# Altium schematic sheet lcd_pin.SchDoc
size A
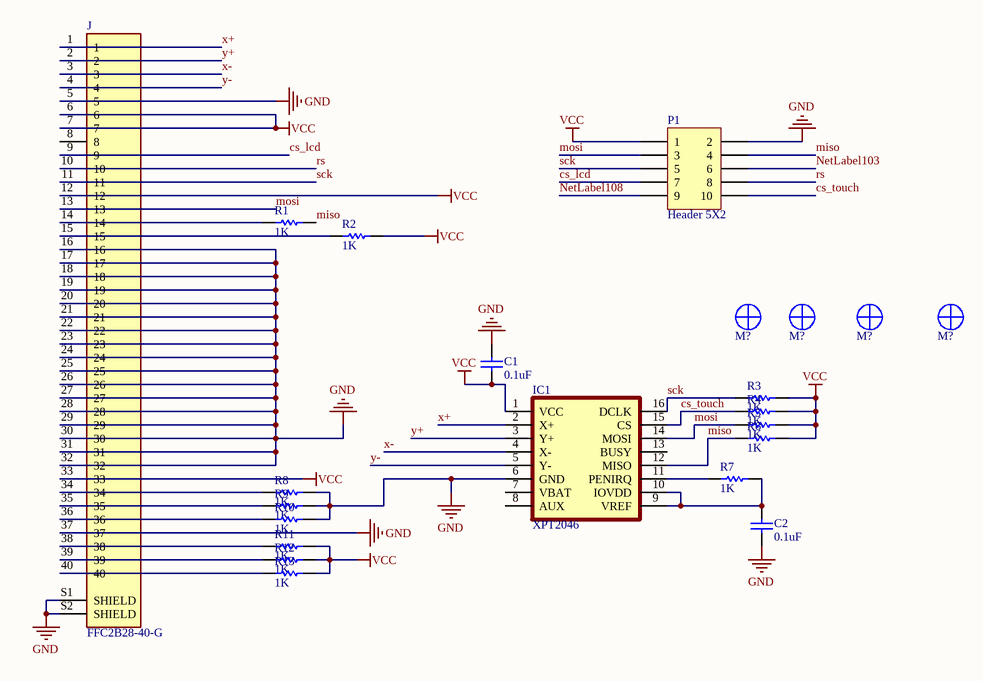
[diagram p0: lcd_pin.SchDoc]

## Parts
(Parts that share a designator on the sheet are numbered #1, #2 ... from top to bottom, then left to right.)
C1  0.1uF  [CAPC4817X12N]
C2  0.1uF  [CAPC4817X12N]
IC1  XPT2046  [TSSOP16]
J  FFC2B28-40-G  [GCT_FFC2B28-40-G]
M?#1  Screw  [Board Screw]  (value not drawn)
M?#2  Screw  [Board Screw]  (value not drawn)
M?#3  Screw  [Board Screw]  (value not drawn)
M?#4  Screw  [Board Screw]  (value not drawn)
P1  Header 5X2  [HDR2X5]
R1  1K  [RESC4817X04N]
R2  1K  [RESC4817X04N]
R3  1K  [RESC4817X04N]
R4  1K  [RESC4817X04N]
R5  1K  [RESC4817X04N]
R6  1K  [RESC4817X04N]
R7  1K  [RESC4817X04N]
R8  1K  [RESC4817X04N]
R9  1K  [RESC4817X04N]
R10  1K  [RESC4817X04N]
R11  1K  [RESC4817X04N]
R12  1K  [RESC4817X04N]
R13  1K  [RESC4817X04N]

## Nets
GND: C1.2 C2.1 IC1.6(GND) J.5 J.16 J.17 J.18 J.19 J.20 J.21 J.22 J.23 J.24 J.25 J.26 J.27 J.28 J.29 J.30 J.31 J.32 J.37 J.S1(SHIELD) J.S2(SHIELD) P1.2 R8.2 R9.2 R10.2
VCC: C1.1 IC1.1(VCC) J.6 J.7 J.12 J.33 P1.1 R2.2 R3.2 R4.2 R5.2 R6.2 R11.2 R12.2 R13.2
cs_lcd: J.9 P1.7
cs_touch: IC1.15(CS) P1.10 R4.1
miso: IC1.12(MISO) P1.4 R1.2 R6.1
mosi: IC1.14(MOSI) J.13 P1.3 R5.1
NetLabel103: P1.6
NetLabel108: P1.9
rs: J.10 P1.8
sck: IC1.16(DCLK) J.11 P1.5 R3.1
x+: IC1.2(X+) J.1
x-: IC1.4(X-) J.3
y+: IC1.3(Y+) J.2
y-: IC1.5(Y-) J.4
NetC2_2: C2.2 IC1.9(VREF) IC1.10(IOVDD) R7.2
NetIC1_11: IC1.11(PENIRQ) R7.1
NetJ_14: J.14 R1.1
NetJ_15: J.15 R2.1
NetJ_34: J.34 R8.1
NetJ_35: J.35 R9.1
NetJ_36: J.36 R10.1
NetJ_38: J.38 R11.1
NetJ_39: J.39 R12.1
NetJ_40: J.40 R13.1

Not connected (* = marked no-connect by the designer): IC1 7(VBAT) 8(AUX) 13(BUSY); J 8

## Library data of the parts
C1 C2 = CAP SMD 1206: CAP 1206; Designer: Abbas Basereh; Desc.: CAP SMD 1206; Data: 16-12-2016
IC1 = XPT2046: RASPBERRY PI 3.5 TFT DISPLAY; MF: Xptek; Package: Package; Price: None; Value: *; SnapEDA_Link: https://www.snapeda.com/parts/XPT2046/Xptek/view-part/?ref=snap; MP: XPT2046; Availability: Not in stock; Check_prices: https://www.snapeda.com/parts/XPT2046/Xptek/view-part/?ref=eda
J = FFC2B28-40-G: 40 Position FFC, FPC Connector Contacts, Top and Bottom 0.020 _0.50mm_ Surface Mount, Right Angle; MF: Global Connector Technology; Value: *; MP: FFC2B28-40-G; Package: Package Analog Devices; Price: None; Availability: Unavailable; SnapEDA_Link: https://www.snapeda.com/parts/FFC2B28-40-G/Global%20Connector%20Technology/view-part/4223068/?ref=snap
M?#1-M?#4 = Board Screw 3MM: Board Screw With Spacer
P1 = Header 5X2: Header, 5-Pin, Dual row; LatestRevisionDate: 17-Jul-2002; LatestRevisionNote: Re-released for DXP Platform.; Publisher: Altium Limited
R1-R13 = RES 1206 0.25W: RES 1206; Designer: Abbas Basereh; Desc.: RES SMD 1206; Data: 16-12-2016